# EAGLE schematic hvreg_feedback_2PS_ACDC (EAGLE 7.2.0)
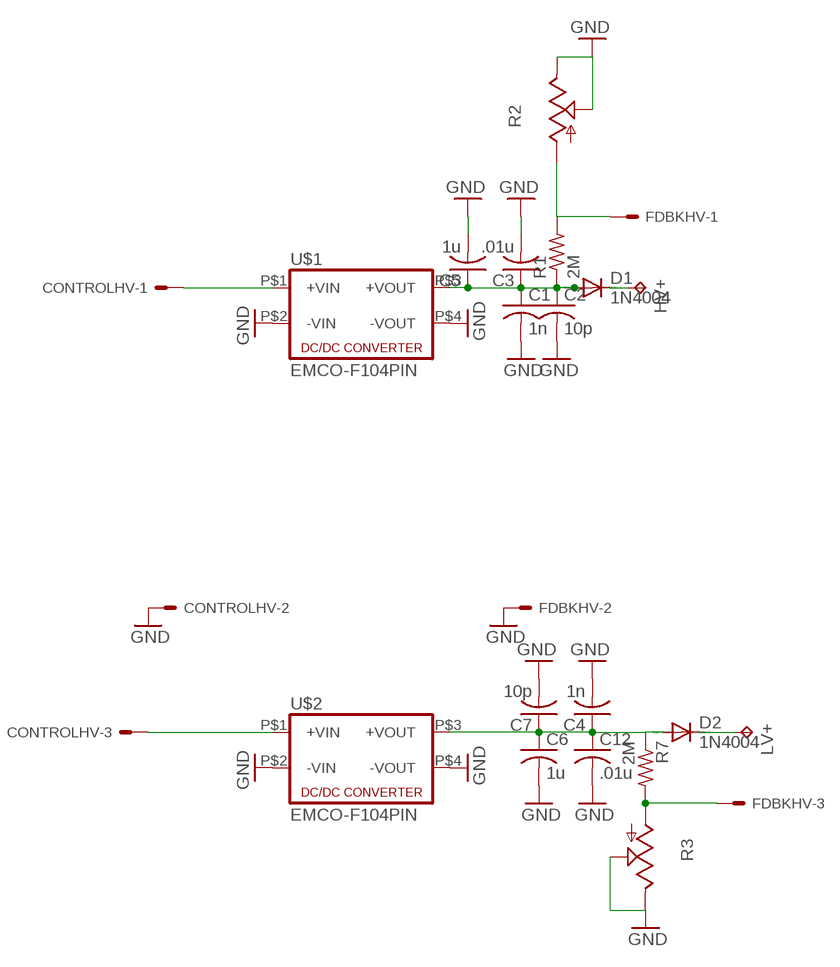
[diagram p0: schematic, sheet 1]

## Parts
C1  1n  C-US075-042X103  [C075-042X103]
C2  10p  C-US075-042X103  [C075-042X103]
C3  .01u  C-US075-042X103  [C075-042X103]
C4  1n  C-US075-042X103  [C075-042X103]
C5  1u  C-US275-205X316  [C275-205X316]
C6  1u  C-US275-205X316  [C275-205X316]
C7  10p  C-US075-042X103  [C075-042X103]
C12  .01u  C-US075-042X103  [C075-042X103]
CONTROLHV  KK-156-3  [KK-156-3]
D1  1N4004  [DO41-10]
D2  1N4004  [DO41-10]
FDBKHV  KK-156-3  [KK-156-3]
HV+  TPPAD1-20Y  [P1-20Y]
LV+  TPPAD1-20Y  [P1-20Y]
R1  2M  R-US_0207/12  [0207/12]
R2  TRIM_US-B90P  [SP19L]
R3  TRIM_US-B90P  [SP19L]
R7  2M  R-US_0207/12  [0207/12]
U$1  EMCO-F104PIN  [EMCO-F]
U$2  EMCO-F104PIN  [EMCO-F]

## Nets
GND: C1.2 C2.2 C3.2 C4.2 C5.2 C6.2 C7.2 C12.2 CONTROLHV.2 FDBKHV.2 R2.E R2.S R3.E R3.S U$1.P$2(-VIN) U$1.P$4(-VOUT) U$2.P$2(-VIN) U$2.P$4(-VOUT)
N$1: C1.1 C2.1 C3.1 C5.1 D1.A R1.1 U$1.P$3(+VOUT)
N$2: C4.1 C6.1 C7.1 C12.1 D2.A R7.1 U$2.P$3(+VOUT)
N$3: FDBKHV.1 R1.2 R2.A
N$4: CONTROLHV.1 U$1.P$1(+VIN)
N$5: CONTROLHV.3 U$2.P$1(+VIN)
N$6: D1.C HV+.TP
N$7: D2.C LV+.TP
N$8: FDBKHV.3 R3.A R7.2

## Library data of the parts
C1-C7 C12 = rcl:C-US: CAPACITOR, American symbol
CONTROLHV FDBKHV = con-molex:KK-156-3: KK 156 HEADER Source: http://www.molex.com/pdm_docs/sd/026604100_sd.pdf; OC_FARNELL: unknown; OC_NEWARK: unknown
D1 D2 = diode:1N4004: DIODE general purpose rectifier, 1 A
HV+ LV+ = testpad:TP: Test pad
R1 R7 = resistor:R-US_: RESISTOR, American symbol
R2 R3 = pot:TRIM_US-: POTENTIOMETER
U$1 U$2 = dc-dc-converter:EMCO-F10